# Altium schematic sheet outputmixer.SchDoc
size A
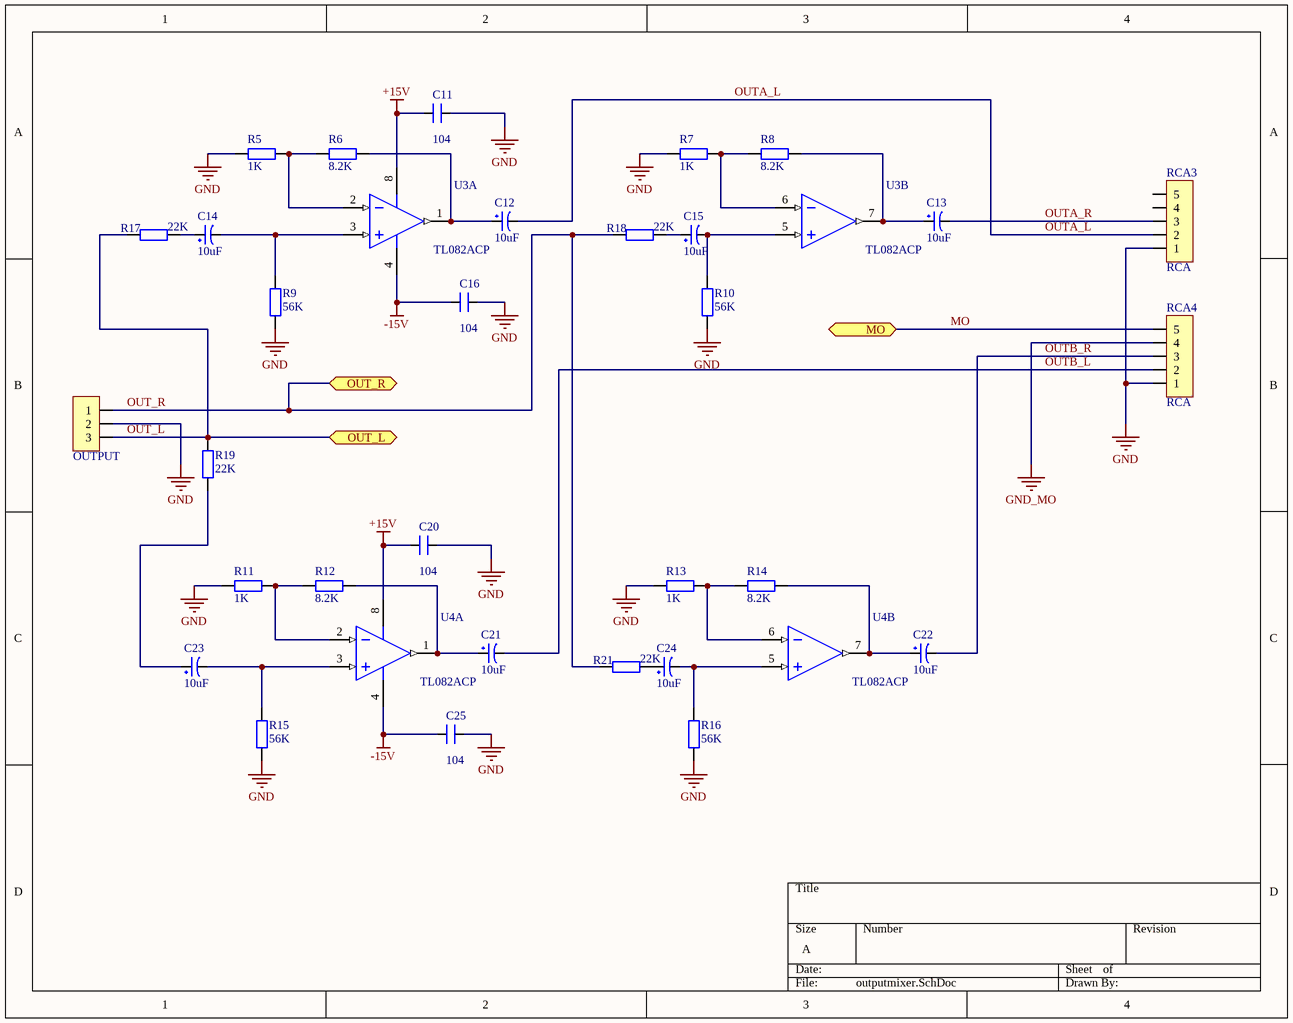
[diagram p0: outputmixer.SchDoc]

## Parts
C11  104  [TU_GOM(104-->105pF)]
C12  10uF  [CAP5x12]
C13  10uF  [CAP5x12]
C14  10uF  [CAP5x12]
C15  10uF  [CAP5x12]
C16  104  [TU_GOM(104-->105pF)]
C20  104  [TU_GOM(104-->105pF)]
C21  10uF  [CAP5x12]
C22  10uF  [CAP5x12]
C23  10uF  [CAP5x12]
C24  10uF  [CAP5x12]
C25  104  [TU_GOM(104-->105pF)]
OUTPUT  Header 3_MH  [HEADER 3]  (value not drawn)
R5  1K  [TRO_VACH_ 1/4W]
R6  8.2K  [TRO_VACH_ 1/4W]
R7  1K  [TRO_VACH_ 1/4W]
R8  8.2K  [TRO_VACH_ 1/4W]
R9  56K  [TRO_VACH_ 1/4W]
R10  56K  [TRO_VACH_ 1/4W]
R11  1K  [TRO_VACH_ 1/4W]
R12  8.2K  [TRO_VACH_ 1/4W]
R13  1K  [TRO_VACH_ 1/4W]
R14  8.2K  [TRO_VACH_ 1/4W]
R15  56K  [TRO_VACH_ 1/4W]
R16  56K  [TRO_VACH_ 1/4W]
R17  22K  [TRO_VACH_ 1/4W]
R18  22K  [TRO_VACH_ 1/4W]
R19  22K  [TRO_VACH_ 1/4W]
R21  22K  [TRO_VACH_ 1/4W]
RCA3  RCA  [RCA3P]
RCA4  RCA  [RCA3P]
U3  TL082ACP  [DIP8]  (parts A,B of 2)
U4  TL082ACP  [DIP8]  (parts A,B of 2)

## Ports
MO, OUT_L, OUT_R

## Nets
+15V: C11.1 C20.1 U3.8(V+) U4.8(V+)
-15V: C16.1 C25.1 U3.4(V-) U4.4(V-)
GND: C11.2 C16.2 C20.2 C25.2 OUTPUT.2 R5.1 R7.1 R9.1 R10.1 R11.1 R13.1 R15.1 R16.1 RCA3.1 RCA4.1
GND_MO: RCA4.4
MO: RCA4.5 ; port MO
OUT_L: OUTPUT.3 R17.1 R19.2 ; port OUT_L
OUT_R: OUTPUT.1 R18.1 R21.1 ; port OUT_R
OUTA_L: C12.2 RCA3.2
OUTA_R: C13.2 RCA3.3
OUTB_L: C21.2 RCA4.2
OUTB_R: C22.2 RCA4.3
NetC12_1: C12.1 R6.1 U3.1(OUT)
NetC13_1: C13.1 R8.1 U3.7(OUT)
NetC14_1: C14.1 R17.2
NetC14_2: C14.2 R9.2 U3.3(IN+)
NetC15_1: C15.1 R18.2
NetC15_2: C15.2 R10.2 U3.5(IN+)
NetC21_1: C21.1 R12.1 U4.1(OUT)
NetC22_1: C22.1 R14.1 U4.7(OUT)
NetC23_1: C23.1 R19.1
NetC23_2: C23.2 R15.2 U4.3(IN+)
NetC24_1: C24.1 R21.2
NetC24_2: C24.2 R16.2 U4.5(IN+)
NetR5_2: R5.2 R6.2 U3.2(IN-)
NetR7_2: R7.2 R8.2 U3.6(IN-)
NetR11_2: R11.2 R12.2 U4.2(IN-)
NetR13_2: R13.2 R14.2 U4.6(IN-)

Not connected (* = marked no-connect by the designer): RCA3 4 5

## Library data of the parts
C11 C16 C20 C25 = TU_MICA_ 104 100V(2A104J)_MH: Value: 0.1uF
C12 C13 C21 C22 = TU_HOA_4.7uF_100V_MH: Value: 4700uF/50V
C14 C15 C23 C24 = TU_HOA_10uF_16V_MH: Value: 10uF/50V; Description 1: 10 => 220uF/6,3V/10V - 10uF => 100uF/16V; Description 2: 0,1uF => 33uF/50V - 10uF => 22uF/63V; Description 3: 0,47uF => 10uF/100V
OUTPUT = Header 3_MH: Header 3P XH2.54 thẳng
R5-R19 R21 = TRO_VACH_1/4W_MH
RCA3 RCA4 = Header 5_MH: Header 5P XH2.54 thẳng
U3 U4 = TL082ACP: JFET-Input Operational Amplifier; Published: 17-Jul-2002; LatestRevisionDate: 06-Jun-2005; LatestRevisionNote: Stylized 3D Model Added.; DatasheetVersion: 1988; PackageReference: 626-05; Publisher: Altium Limited; PackageDescription: DIP; 8 Leads; Row Spacing 7.62 mm; Pitch 2.54 mm; ComponentLink1Description: Manufacturer Link; ComponentLink1URL: http://www.onsemi.com/site/products/parametrics/0,4446,251,00.html